# EAGLE design ahrs (EAGLE 9.6.1)

## Sheet 1 of 2
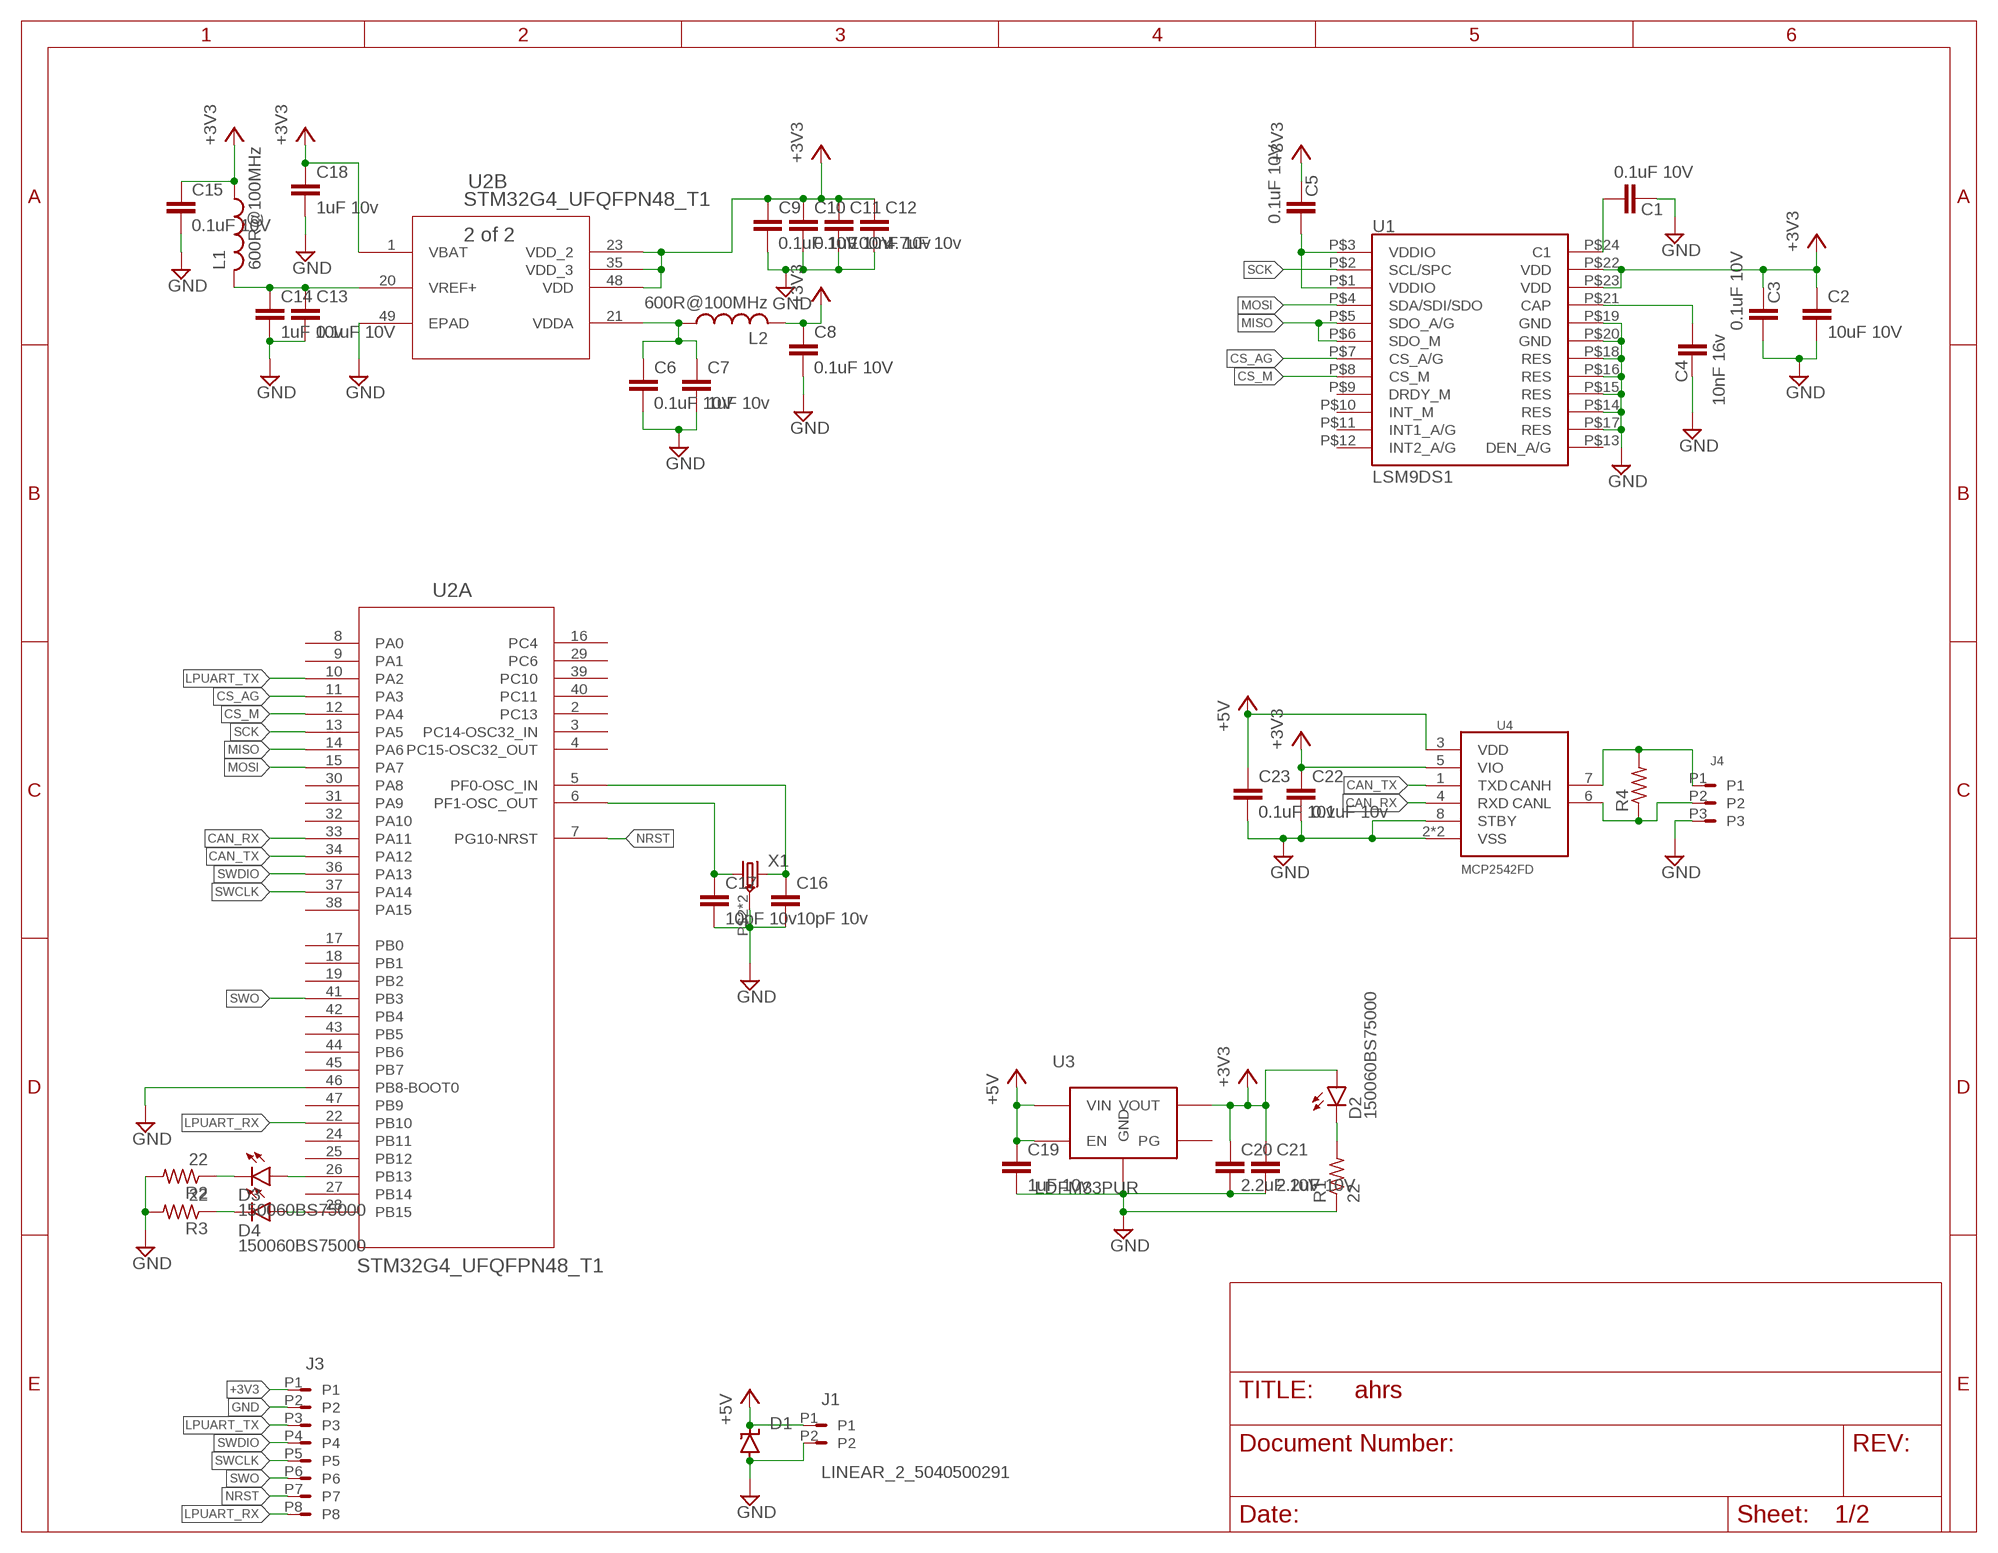
[diagram p0: schematic, sheet 1]

### Parts
C1  0.1uF 10V  C0603  [C0603]
C2  10uF 10V  C0603  [C0603]
C3  0.1uF 10V  C0603  [C0603]
C4  10nF 16v  C0603  [C0603]
C5  0.1uF 10V  C0603  [C0603]
C6  0.1uF 10V  C0603  [C0603]
C7  1uF 10v  C0603  [C0603]
C8  0.1uF 10V  C0603  [C0603]
C9  0.1uF 10V  C0603  [C0603]
C10  0.1uF 10V  C0603  [C0603]
C11  100nF 10v  C0603  [C0603]
C12  4.7uF 10v  C0603  [C0603]
C13  0.1uF 10V  C0603  [C0603]
C14  1uF 10v  C0603  [C0603]
C15  0.1uF 10V  C0603  [C0603]
C16  10pF 10v  C0603  [C0603]
C17  10pF 10v  C0603  [C0603]
C18  1uF 10v  C0603  [C0603]
C19  1uF 10v  C0603  [C0603]
C20  2.2uF 10V  C0603  [C0603]
C21  2.2uF 10V  C0603  [C0603]
C22  0.1uF 10v  C0603  [C0603]
C23  0.1uF 10v  C0603  [C0603]
D1  TVS_SOD123  [SOD123]
D2  150060BS75000  LED_0603  [D0603]
D3  150060BS75000  LED_0603  [D0603]
D4  150060BS75000  LED_0603  [D0603]
J1  LINEAR_2_5040500291  [MOLEX_5040500291]
J3  LINEAR_85040500891  [MOLEX_5040500891]
J4  LINEAR_35040500391  [MOLEX_5040500391]
L1  600R@100MHz  DC_CHOKE_FERRITE_BEAD_0603  [L0603]
L2  600R@100MHz  DC_CHOKE_FERRITE_BEAD_0603  [L0603]
R1  22  R0603  [R0603]
R2  22  R0603  [R0603]
R3  22  R0603  [R0603]
R4  R0603  [R0603]
U1  LSM9DS1  [LGA24_3.5X3X1]
U2  STM32G4_UFQFPN48_T1  [UFQFPN-48_7X7X0P55MM]
U3  LDFM33PUR  [DFN6_2X2]
U4  MCP2542FD  [TDFN_2X3]
X1  CRYSTAL_NX2016SA-24MHZ-EXS00A-CS11335  [NX201SA]

### Nets
+3V3 [power]: C2.1 C3.1 C5.1 C8.1 C9.1 C10.1 C11.1 C12.1 C15.1 C18.1 C20.1 C21.1 C22.1 D2.2(A) J3.P1 L1.1 L2.2 U1.P$22(VDD) U1.P$23(VDD) U2.1(B:VBAT) U2.23(B:VDD_2) U2.35(B:VDD_3) U2.48(B:VDD) U3.PIN1(VOUT) U4.5(VIO)
+5V [power]: C19.1 C23.1 D1.C J1.P1 U3.PIN5(EN) U3.PIN6(VIN) U4.3(VDD)
CAN_RX: U2.33(A:PA11) U4.4(RXD)
CAN_TX: U2.34(A:PA12) U4.1(TXD)
CS_AG: U1.P$7(CS_A/G) U2.11(A:PA3)
CS_M: U1.P$8(CS_M) U2.12(A:PA4)
GND [power]: C1.1 C2.2 C3.2 C4.1 C6.2 C7.2 C8.2 C9.2 C10.2 C11.2 C12.2 C13.2 C14.2 C15.2 C16.2 C17.2 C18.2 C19.2 C20.2 C21.2 C22.2 C23.2 D1.A J1.P2 J3.P2 J4.P3 R1.1 R2.2 R3.2 U1.P$14(RES) U1.P$15(RES) U1.P$16(RES) U1.P$17(RES) U1.P$18(RES) U1.P$19(GND) U1.P$20(GND) U2.46(A:PB8-BOOT0) U2.49(B:EPAD) U3.PAD(GND) U3.PIN4(GND) U4.2(VSS) U4.8(STBY) U4.PAD(VSS) X1.P$2(GND) X1.P$4(GND)
LPUART_RX: J3.P8 U2.22(A:PB10)
LPUART_TX: J3.P3 U2.10(A:PA2)
MISO: U1.P$5(SDO_A/G) U1.P$6(SDO_M) U2.14(A:PA6)
MOSI: U1.P$4(SDA/SDI/SDO) U2.15(A:PA7)
N$1: D2.1(C) R1.2
N$2: C1.2 U1.P$24(C1)
N$3: C4.2 U1.P$21(CAP)
N$4: C5.2 U1.P$1(VDDIO) U1.P$3(VDDIO)
N$5: C17.1 U2.6(A:PF1-OSC_OUT) X1.P$1
N$6: C16.1 U2.5(A:PF0-OSC_IN) X1.P$3
N$7: D4.2(A) U2.28(A:PB15)
N$8: D3.2(A) U2.26(A:PB13)
N$9: D3.1(C) R2.1
N$10: D4.1(C) R3.1
N$11: J4.P1 R4.2 U4.7(CANH)
N$12: J4.P2 R4.1 U4.6(CANL)
NRST: J3.P7 U2.7(A:PG10-NRST)
SCK: U1.P$2(SCL/SPC) U2.13(A:PA5)
SWCLK: J3.P5 U2.37(A:PA14)
SWDIO: J3.P4 U2.36(A:PA13)
SWO: J3.P6 U2.41(A:PB3)
VDDA [power]: C6.1 C7.1 L2.1 U2.21(B:VDDA)
VREF [power]: C13.1 C14.1 L1.2 U2.20(B:VREF+)
Unconnected: J1.MNT@1(GND) J1.MNT@2(GND) J3.MNT@1(GND) J3.MNT@2(GND) J4.MNT@1(GND) J4.MNT@2(GND) U1.P$9(DRDY_M) U1.P$10(INT_M) U1.P$11(INT1_A/G) U1.P$12(INT2_A/G) U1.P$13(DEN_A/G) U2.2(A:PC13) U2.3(A:PC14-OSC32_IN) U2.4(A:PC15-OSC32_OUT) U2.8(A:PA0) U2.9(A:PA1) U2.16(A:PC4) U2.17(A:PB0) U2.18(A:PB1) U2.19(A:PB2) U2.24(A:PB11) U2.25(A:PB12) U2.27(A:PB14) U2.29(A:PC6) U2.30(A:PA8) U2.31(A:PA9) U2.32(A:PA10) U2.38(A:PA15) U2.39(A:PC10) U2.40(A:PC11) U2.42(A:PB4) U2.43(A:PB5) U2.44(A:PB6) U2.45(A:PB7) U2.47(A:PB9) U3.PIN3(PG)

## Sheet 2 of 2
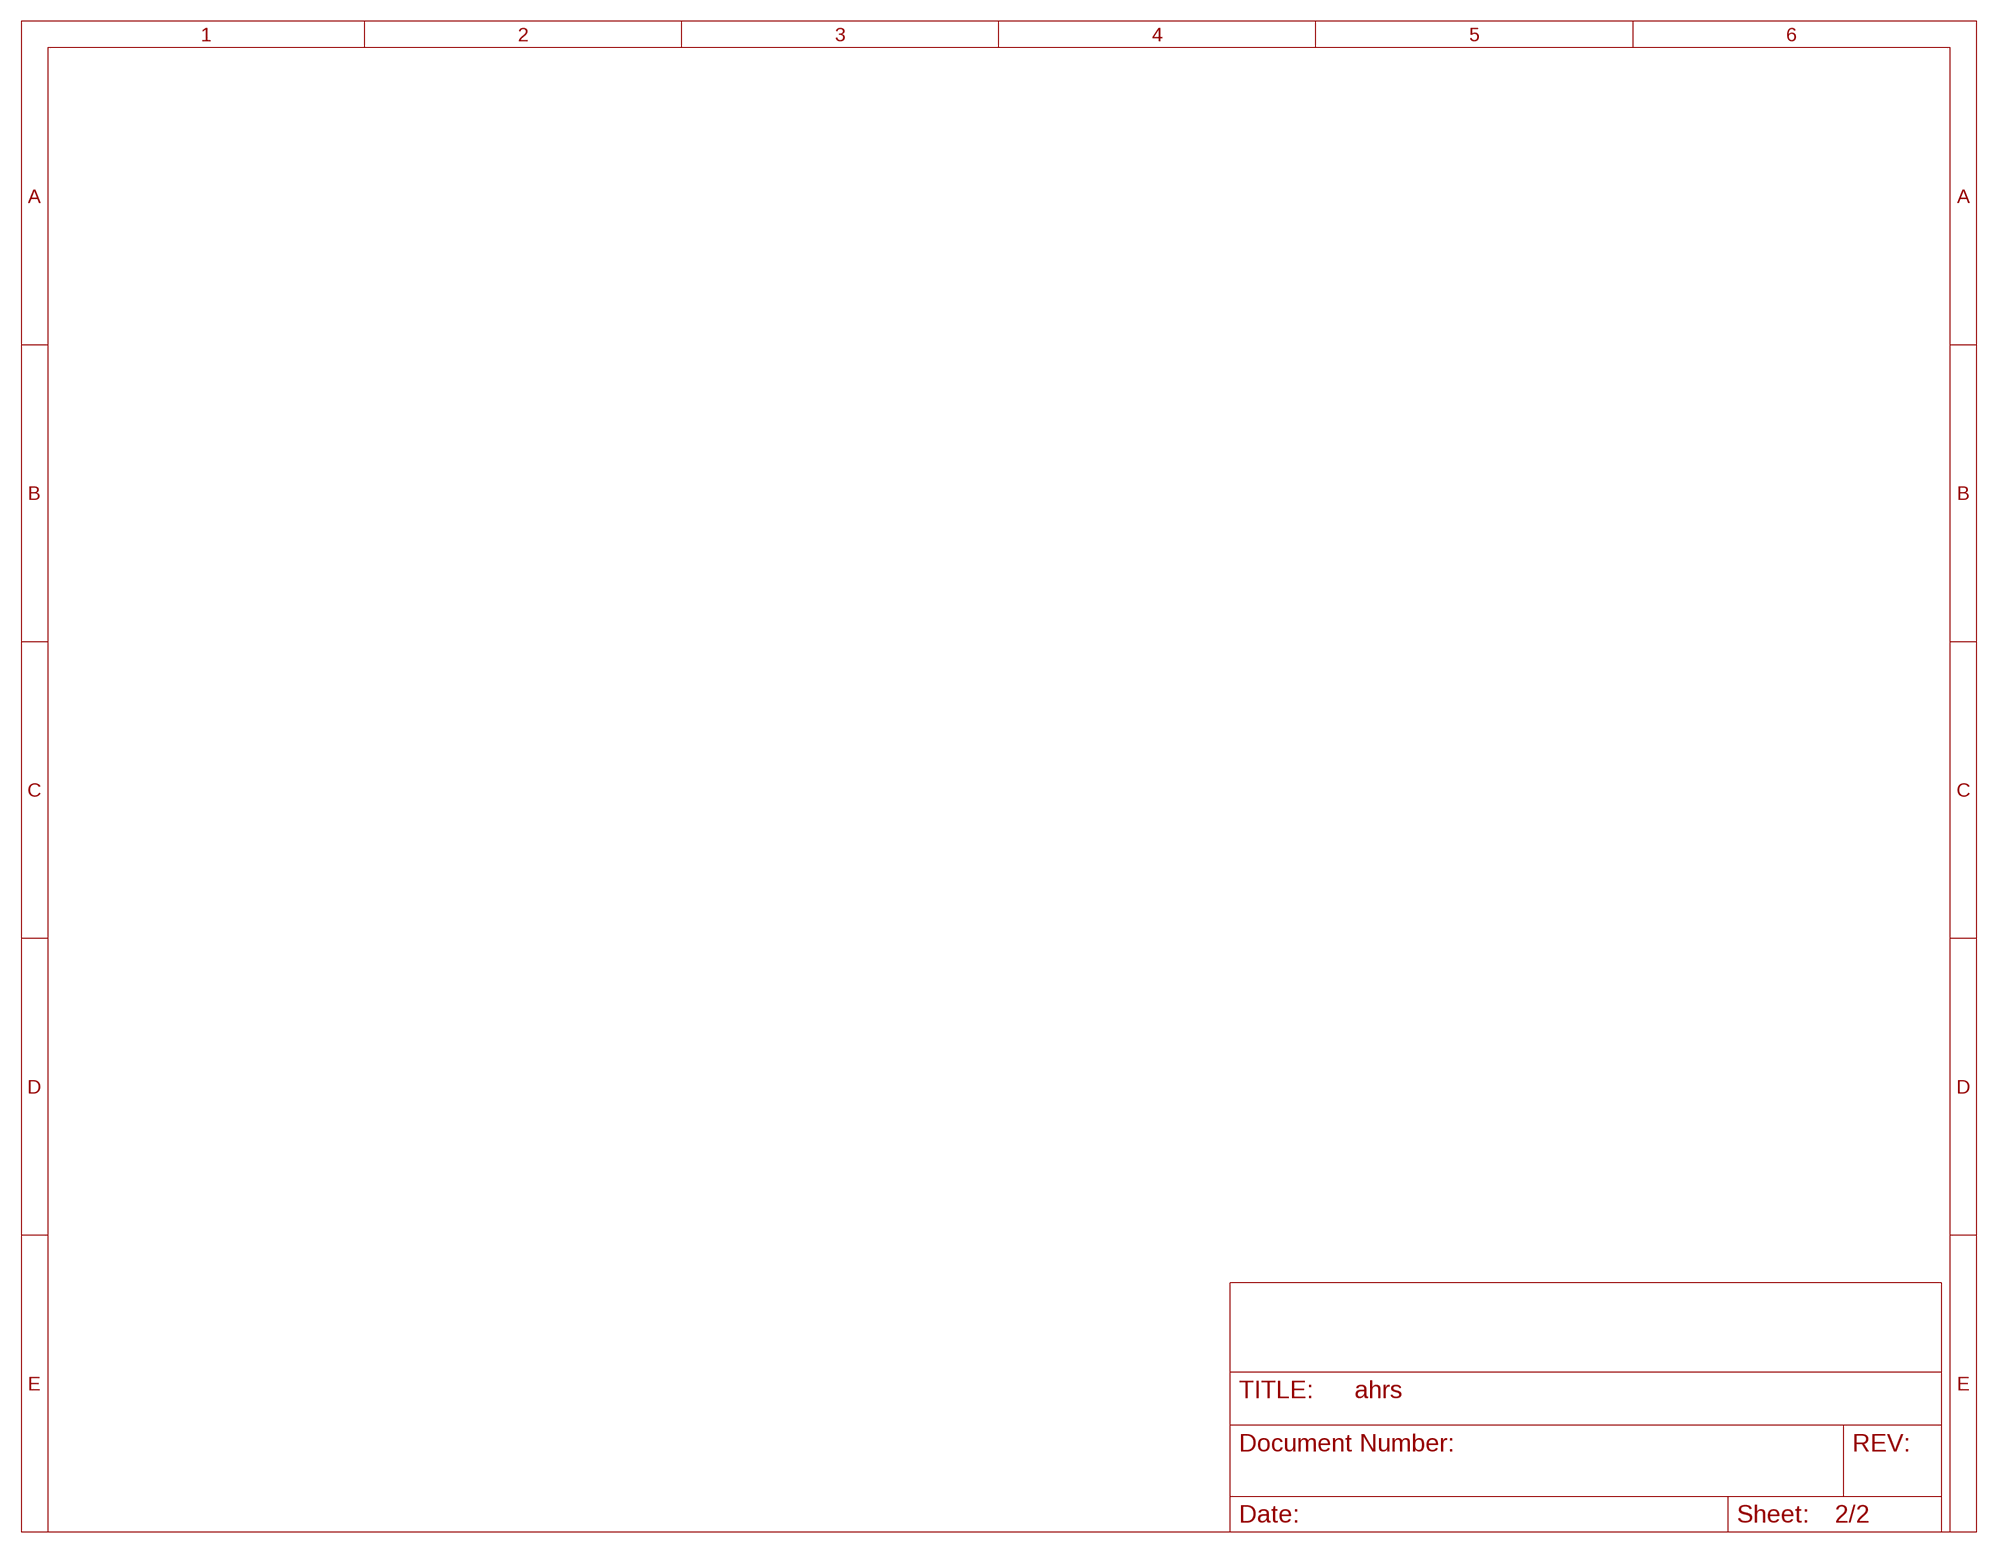
[diagram p1: schematic, sheet 2]

## Library data of the parts
C1-C23 = _T_rcl:C
D1 = _T_rcl:TVS
D2-D4 = _T_rcl:LED
J1 = _T_conn:LINEAR_2
J3 = _T_conn:LINEAR_8
J4 = _T_conn:LINEAR_3
L1 L2 = _T_rcl:DC_CHOKE
R1-R4 = _T_rcl:R
U1 = _T_ic:LSM9DS1: datasheet
U2 = _T_ic:STM32G4_UFQFPN48_T1; BUILT_BY: EMA_Jessica; COPYRIGHT: Copyright (C) 2016 Accelerated Designs. All rights reserved; MANUFACTURER_PART_NUMBER: stm32g4_ufqfpn48_t1; VENDOR: STMicroelectronics
U3 = _T_ic:LDFM
U4 = _T_ic:MCP2542FD
X1 = _T_ic:CRYSTAL

## Net classes
1 power: width 0.3 mm

## Board
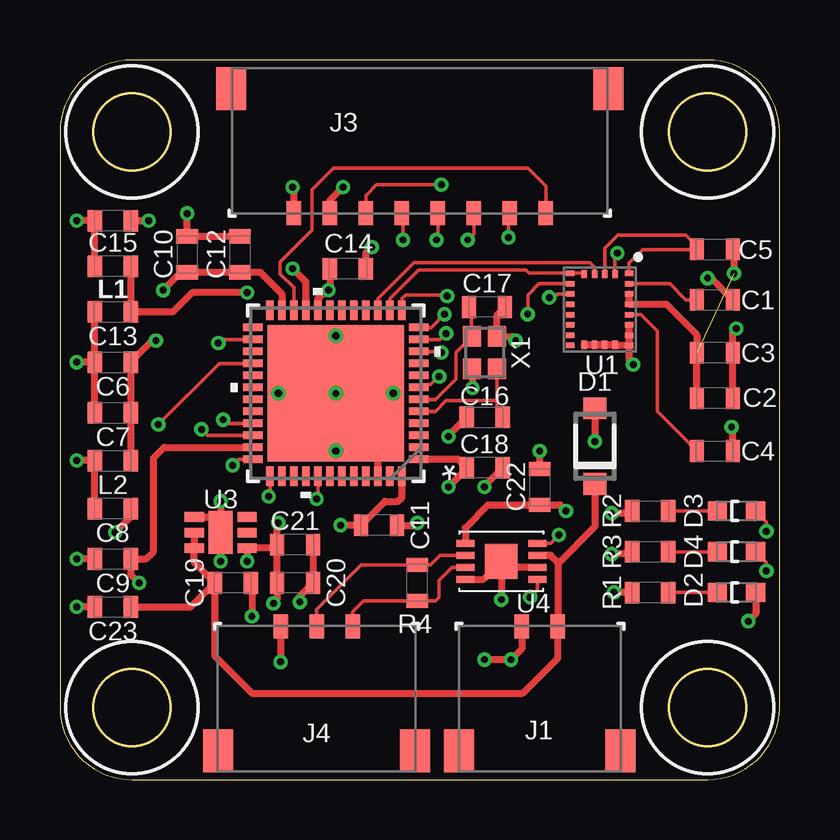
[diagram p2: board, top side]
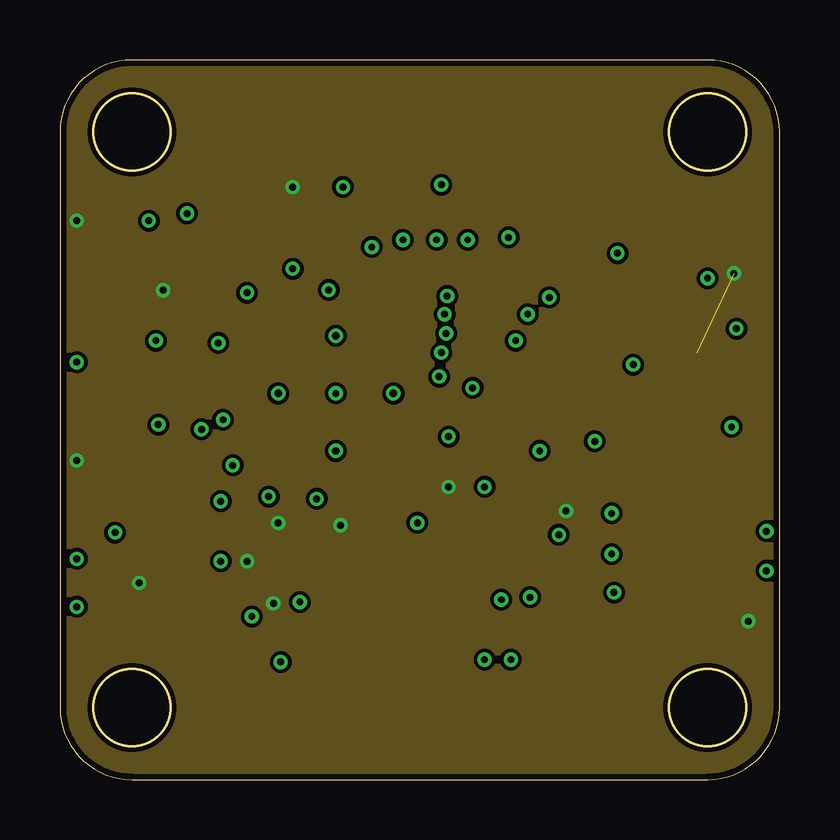
[diagram p3: board, inner layer Route2]
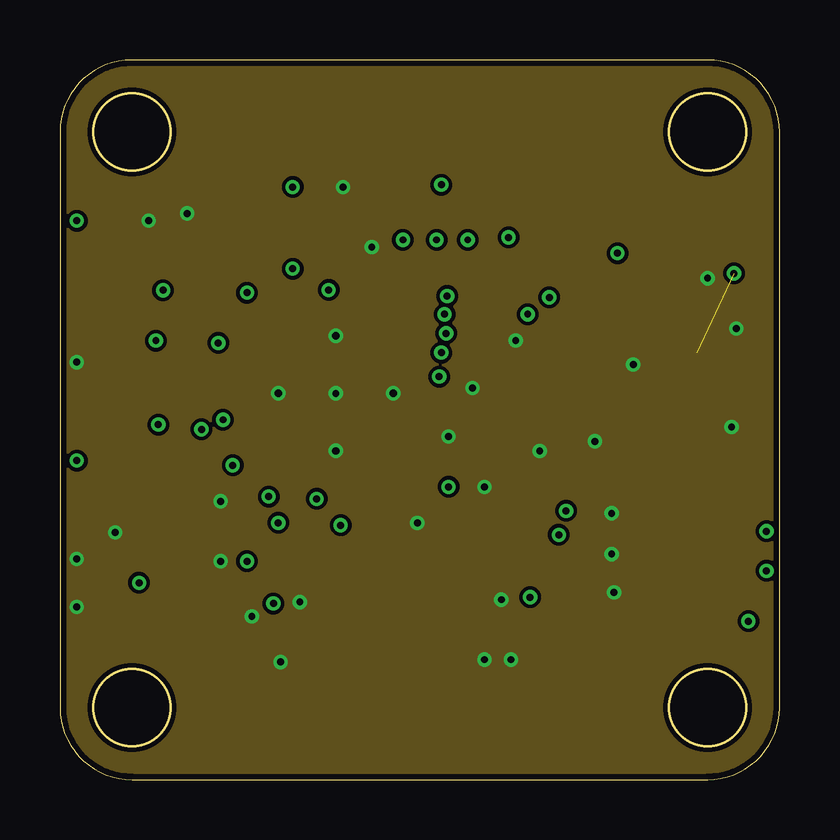
[diagram p4: board, inner layer Route15]
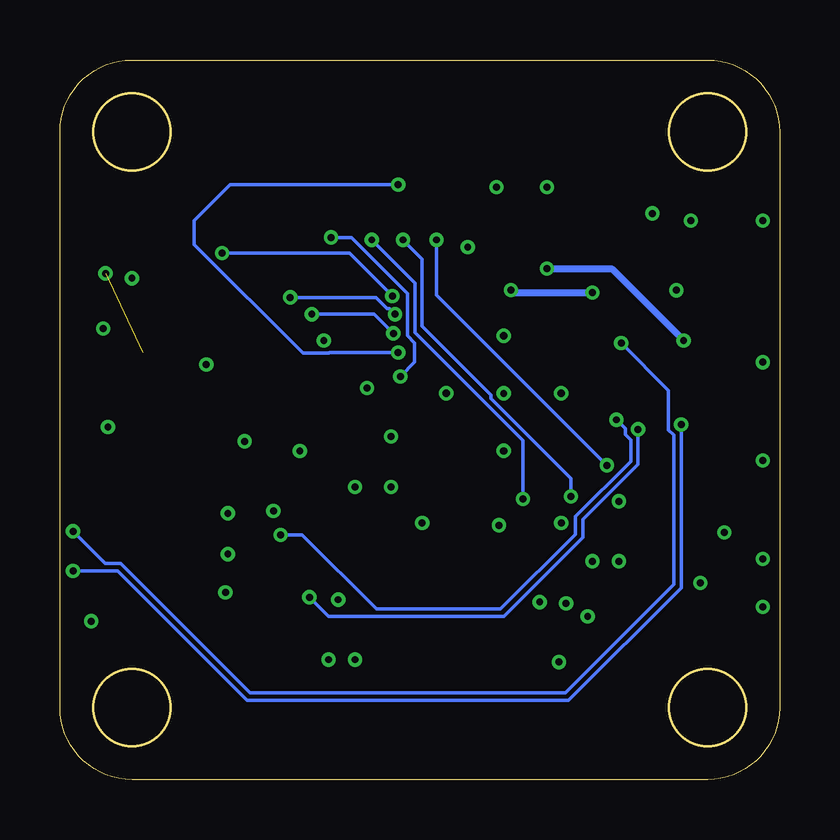
[diagram p5: board, bottom side, seen from below]

Size 30 x 30 mm. Coordinates in mm from the lower left corner, seen from the top.
Outline: 30,27 arc90 27,30 3,30 arc90 0,27 0,3 arc90 3,0 27,0 arc90 30,3 30,27
Outline: circle at 3,3 radius 1.6
Outline: circle at 27,3 radius 1.6
Outline: circle at 3,27 radius 1.6
Outline: circle at 27,27 radius 1.6
Copper layers (1*2*15*16): Top 0.035mm / dielectric 0.11mm / Route2 0.035mm / dielectric 1.31mm / Route15 0.035mm / dielectric 0.11mm / Bottom 0.035mm
Design rules "pcbway_4_layer_TIM": minimum track width 6mil, minimum drill 0.29mm, track to track 6mil, track to pad 6mil, pad to pad 6mil, via to via 6mil, smd to smd 0mil, copper to edge 0.25mm, drill to drill 10mil, minimum pad ring 6mil, minimum via ring 6mil, stop-mask expansion 2mil, vias tented up to drill 0mil, thermal gap 10mil

### Footprints (pad centres in the part's own frame; a part is rotated, then mirrored left to right if it is on the bottom)
C0603 = smd 0.6 x 0.9: 1 0.75,0; 2 -0.75,0
SOD123 = smd 0.9 x 0.95: A 1.575,0; C -1.575,0
D0603 = smd 0.8 x 0.8: 1 -0.8,0; 2 0.8,0
MOLEX_5040500291 = smd 1.25 x 1.8: MNT@1 3.355,5.2; MNT@2 -3.355,5.2 | smd 0.6 x 1: P1 -0.75,0.01; P2 0.75,0.01
MOLEX_5040500891 = smd 1.25 x 1.8: MNT@1 7.855,5.2; MNT@2 -7.855,5.2 | smd 0.6 x 1: P1 -5.25,0.01; P2 -3.75,0.01; P3 -2.25,0.01; P4 -0.75,0.01; P5 0.75,0.01; P6 2.25,0.01; P7 3.75,0.01; P8 5.25,0.01
MOLEX_5040500391 = smd 1.25 x 1.8: MNT@1 4.105,5.2; MNT@2 -4.105,5.2 | smd 0.6 x 1: P1 -1.5,0.01; P2 0,0.01; P3 1.5,0.01
L0603 = smd 0.6 x 0.9: 1 0.75,0; 2 -0.75,0
R0603 = smd 0.6 x 0.9: 1 0.75,0; 2 -0.75,0
LGA24_3.5X3X1 = smd 0.23 x 0.35: P$1 -1.505,1.225; P$6 -1.505,-1.225; P$7 -1.075,-1.225; P$8 -0.645,-1.225; P$9 -0.215,-1.225; P$10 0.215,-1.225; P$11 0.645,-1.225; P$12 1.075,-1.225; P$13 1.505,-1.225; P$18 1.505,1.225; P$19 1.075,1.225; P$20 0.645,1.225; P$21 0.215,1.225; P$22 -0.215,1.225; P$23 -0.645,1.225; P$24 -1.075,1.225 | smd 0.35 x 0.23: P$2 -1.475,0.645; P$3 -1.475,0.215; P$4 -1.475,-0.215; P$5 -1.475,-0.645; P$14 1.475,-0.645; P$15 1.475,-0.215; P$16 1.475,0.215; P$17 1.475,0.645
UFQFPN-48_7X7X0P55MM = smd 0.813 x 0.305: 1 -3.454,2.75; 2 -3.454,2.25; 3 -3.454,1.75; 4 -3.454,1.25; 5 -3.454,0.75; 6 -3.454,0.25; 7 -3.454,-0.25; 8 -3.454,-0.75; 9 -3.454,-1.25; 10 -3.454,-1.75; 11 -3.454,-2.25; 12 -3.454,-2.75; 25 3.454,-2.75; 26 3.454,-2.25; 27 3.454,-1.75; 28 3.454,-1.25; 29 3.454,-0.75; 30 3.454,-0.25; 31 3.454,0.25; 32 3.454,0.75; 33 3.454,1.25; 34 3.454,1.75; 35 3.454,2.25; 36 3.454,2.75 | smd 0.305 x 0.813: 13 -2.75,-3.454; 14 -2.25,-3.454; 15 -1.75,-3.454; 16 -1.25,-3.454; 17 -0.75,-3.454; 18 -0.25,-3.454; 19 0.25,-3.454; 20 0.75,-3.454; 21 1.25,-3.454; 22 1.75,-3.454; 23 2.25,-3.454; 24 2.75,-3.454; 37 2.75,3.454; 38 2.25,3.454; 39 1.75,3.454; 40 1.25,3.454; 41 0.75,3.454; 42 0.25,3.454; 43 -0.25,3.454; 44 -0.75,3.454; 45 -1.25,3.454; 46 -1.75,3.454; 47 -2.25,3.454; 48 -2.75,3.454 | smd 5.69 x 5.69: 49 0,0
DFN6_2X2 = smd 1.8 x 1: PAD 0,0 | smd 0.4 x 0.8: PIN1 0.65,1.1; PIN2 0,1.1; PIN3 -0.65,1.1; PIN4 -0.65,-1.1; PIN5 0,-1.1; PIN6 0.65,-1.1
TDFN_2X3 = smd 0.3 x 0.75: 1 -0.75,-1.5; 2 -0.25,-1.5; 3 0.25,-1.5; 4 0.75,-1.5; 5 0.75,1.5; 6 0.25,1.5; 7 -0.25,1.5; 8 -0.75,1.5 | smd 1.46 x 1.36: PAD 0,0
NX201SA = smd 0.85 x 0.75: P$1 -0.675,-0.525; P$2 0.675,-0.525; P$3 0.675,0.525; P$4 -0.675,0.525

### Placement (x,y rotation side)
C1  27.3,20 0 top
C2  27.3,15.9 180 top
C3  27.3,17.8 180 top
C4  27.3,13.7 0 top
C5  27.3,22.1 0 top
C6  2.2,17.4 0 top
C7  2.2,15.3 0 top
C8  2.2,11.3 180 top
C9  2.2,9.2 0 top
C10  5.3,21.9 270 top
C11  13.3,10.6 180 top
C12  7.5,21.9 270 top
C13  2.2,19.5 0 top
C14  12,21.3 180 top
C15  2.2,23.3 180 top
C16  17.7,15.1 0 top
C17  17.8,19.7 180 top
C18  17.7,13 180 top
C19  7.2,8.2 180 top
C20  9.8,8.2 180 top
C21  9.8,9.8 180 top
C22  20,12.2 270 top
C23  2.2,7.2 0 top
D1  22.3,13.9 90 top
D2  28.2,7.8 0 top
D3  28.2,11.2 0 top
D4  28.2,9.5 0 top
J1  20,6.4 180 top
J3  15,23.6 0 top
J4  10.7,6.4 180 top
L1  2.2,21.4 180 top
L2  2.2,13.3 0 top
R1  24.6,7.8 180 top
R2  24.6,11.2 0 top
R3  24.6,9.5 0 top
R4  14.9,8.2 90 top
U1  22.5,19.6 270 top
U2  11.5,16.1 180 top
U3  6.7,10.3 270 top
U4  18.4,9.1 90 top
X1  17.7,17.8 270 top

### Tracks (layer width: path | path; a pad name or v marks a point on that pad's centre or on a via)
+3V3  (via drill 0.29)  (1 unrouted)
  Top 0.3: C21.1 C20.1 9.05,7.49 v8.9,7.34 | C21.1 8.9,9.65 U3.PIN1 v7.8,9.1 | C21.1 9.05,10.65 v9.1,10.7 | J3.P1 9.75,24.65 v9.7,24.7 | U4.5 16.9,10.5 17.85,11.45 C22.1 20.85,11.45 v21.1,11.2 | U2.48 14.25,11.75 14.1,11.6 13.55,11.6 C11.1 v11.7,10.6 | U2.1 16.6,13.35 C18.1 16.95,12.95 v16.2,12.2 | D2.2 29,6.9 v28.7,6.6 | U2.23 9.25,20.25 8.35,21.15 C12.1 C10.1 5.05,21.15 v4.3,20.4 | L1.1 C15.1 v0.7,23.3 | v0.7,13.3 L2.2 C8.1 | U2.35 4.35,13.85 3.9,13.4 3.9,9.5 3.6,9.2 C9.1 2.95,8.55 v3.3,8.2 | U1.P$23 U1.P$22 25.29,19.82 26.55,18.55 C3.1 C2.1 | C5.1 28.1,22.05 v28.1,21.1
  pour Route2: -0.4,-0.6 32.4,-0.6 32.4,30.5 -0.5,30.5 -0.5,-0.6
+5V
  Top 0.3: U4.3 20.45,9.35 20.75,9.05 20.75,9 | C19.1 6.45,5.15 8,3.6 19.3,3.6 20.75,5.05 J1.P1 20.75,9 | U3.PIN5 U3.PIN6 5.6,9.05 C19.1 | C23.1 5.45,7.2 C19.1 | D1.C 22.3,10.55 20.75,9
CAN_RX  (via drill 0.29)
  Top 0.152: U2.33 6.95,14.85 v6.8,15 | v20.8,10.2 20.45,9.85 U4.4
  Bottom 0.152: v6.8,15 6.43,14.63 6.43,14.38 6.21,14.16 6.21,13.27 8.51,10.97 8.51,10.23 11.63,7.11 16.8,7.11 19.9,10.2 v20.8,10.2
CAN_TX  (via drill 0.29)
  Top 0.152: U4.1 19.9,7.9 v19.6,7.6 | v5.9,14.6 6.15,14.35 U2.34
  Bottom 0.152: v19.6,7.6 18.8,6.8 11.5,6.8 8.2,10.1 8.2,10.84 5.9,13.14 v5.9,14.6
CS_AG  (via drill 0.29)
  Top 0.152: U2.11 15.85,18.35 v16.1,18.6 | v19.5,19.4 19.5,20.2 19.98,20.68 U1.P$7
  Bottom 0.152: v16.1,18.6 16.9,19.4 v19.5,19.4
CS_M  (via drill 0.29)
  Top 0.152: U2.12 15.49,18.85 v16.04,19.4 | U1.P$8 20.75,20.25 20.6,20.1 v20.4,20.1
  Bottom 0.152: v16.04,19.4 16.27,19.63 16.36,19.63 16.83,20.1 v20.4,20.1
GND  (via drill 0.29, 0.3)
  Top 0.3: U4.2 18.65,8.85 U4.PAD | U4.8 17.65,8.35 U4.PAD | J1.P2 19.25,5.45 v18.8,5 v17.7,5 | J4.P3 v9.2,4.9 | C19.2 8,8.15 v8,6.8 | U4.PAD v18.4,7.5 | C21.2 C20.2 10,7.65 v10,7.4 | C11.2 14.8,10.6 v14.9,10.7 | U3.PIN4 6.7,10.95 U3.PAD | v6.7,11.6 U3.PAD | U3.PAD v6.7,9.1 | C23.2 v0.7,7.2 | C9.2 v0.7,9.2 | U2.46 13.25,14.35 U2.49 | D1.A v22.3,14.1 | C18.2 17.7,12.25 v17.7,12.2 | C22.2 v20,13.7 | X1.P$2 17.2,17.1 v17.2,16.33 | v19,18.3 18.82,18.48 X1.P$4 18.23,19.38 C17.2 | C16.2 16.2,14.35 v16.2,14.3 | R1.1 v23.1,7.8 | R3.2 23.75,9.4 v23,9.4 | R2.2 23.75,11.1 v23,11.1 | C12.2 C10.2 v5.3,23.6 | C15.2 v3.7,23.3 | C6.2 C13.2 | C6.2 v0.7,17.4 | v28.2,18.8 28.05,18.65 C3.2 C2.2 | C1.1 27.15,20.9 v27,20.9 | C4.1 28.05,14.65 v28,14.7 | U1.P$20 U1.P$19 U1.P$18 | U1.P$18 23.18,18.09 U1.P$17 U1.P$16 U1.P$15 U1.P$14 | U1.P$18 23.73,17.48 v23.9,17.3 | J3.P2 11.25,24.15 v11.8,24.7 | C8.2 2.95,10.95 v2.3,10.3 | C7.2 C6.2 | C14.2 12.75,21.95 v13,22.2
  other vias: 11.5,16.1 11.5,13.7 13.9,16.1 11.5,18.5 9.1,16.1
  pour Route15 (no thermals): -0.5,-0.5 32.4,-0.5 32.4,30.5 -0.5,30.5
LPUART_RX
  Top 0.152: U2.22 9.75,20.51 9.17,21.08 9.17,21.57 10.5,22.9 10.5,24.6 11.4,25.5 19.5,25.5 20.25,24.75 J3.P8
LPUART_TX  (via drill 0.29)
  Top 0.152: J3.P3 12.75,24.35 13.2,24.8 v15.9,24.8 | U2.10 15.85,17.85 v15.9,17.8
  Bottom 0.152: v15.9,17.8 18.76,17.8 18.78,17.77 19.87,17.77 24.4,22.3 24.4,23.3 22.9,24.8 v15.9,24.8
MISO
  Top 0.152: U2.14 13.75,20.05 14.95,21.25 19.42,21.25 19.56,21.11 U1.P$6 21.82,21.11 U1.P$5
MOSI
  Top 0.152: U2.15 13.25,20.05 14.75,21.55 22.09,21.55 22.29,21.36 U1.P$4
N$1
  Top 0.152: D2.1 R1.2
N$2
  Top 0.152: C1.2 26.1,20 25.43,20.68 U1.P$24
N$3
  Top 0.152: C4.2 24.9,15.35 24.9,18.7 24.21,19.39 U1.P$21
N$4
  Top 0.152: U1.P$3 22.72,22.16 23.26,22.7 26.1,22.7 26.55,22.25 C5.2 24.3,22.1 23.73,21.52 U1.P$1
N$5
  Top 0.152: U2.6 15.65,15.85 16.5,16.7 16.5,17.8 17.15,18.45 | 17.15,18.45 X1.P$1 | C17.1 17.15,19.6 17.15,18.45
N$6
  Top 0.152: C16.1 18.23,15.32 18.23,15.8 | 18.23,15.8 X1.P$3 | U2.5 15.65,15.35 16.1,15.8 18.23,15.8
N$7  (via drill 0.29)
  Top 0.152: U2.28 6.65,17.35 v4.1,14.8 | v29.45,8.7 29.45,9.05 D4.2
  Bottom 0.152: v4.1,14.8 4.1,8 8.8,3.3 22.2,3.3 27.6,8.7 v29.45,8.7
N$8  (via drill 0.29)
  Top 0.152: D3.2 29.45,10.75 v29.45,10.35 | v6.6,18.2 6.75,18.35 U2.26
  Bottom 0.152: v29.45,10.35 28.11,9.01 27.47,9.01 22.07,3.6 8.93,3.6 4.41,8.13 4.41,14.36 4.63,14.58 4.63,16.23 v6.6,18.2
N$9
  Top 0.152: D3.1 R2.1
N$10
  Top 0.152: D4.1 R3.1
N$11
  Top 0.152: U4.7 16.35,8.85 15.8,8.3 15.8,7.6 15.65,7.45 R4.2 12.65,7.45 12.2,7 J4.P1
N$12
  Top 0.152: U4.6 15.85,9.35 15.45,8.95 R4.1 12.55,8.95 10.7,7.1 J4.P2
NRST  (via drill 0.29)
  Top 0.152: U2.7 15.07,16.47 15.46,16.47 15.79,16.8 v15.81,16.8 | v18.7,22.6 18.7,23.56 J3.P7
  Bottom 0.152: v15.81,16.8 15.21,17.4 15.21,18.2 15.51,18.5 15.51,20.27 17.84,22.6 v18.7,22.6
SCK  (via drill 0.29)
  Top 0.152: U2.13 14.25,20.05 14.4,20.2 16.1,20.2 v16.14,20.16 | v23.24,21.94 23.14,21.84 U1.P$2
  Bottom 0.152: v16.14,20.16 17.93,21.94 v23.24,21.94
SWCLK  (via drill 0.29)
  Top 0.152: U2.37 8.75,11.85 v8.7,11.8 | v15.7,22.5 15.75,22.55 J3.P5
  Bottom 0.152: v8.7,11.8 8.7,12.56 12.03,15.88 12.03,16.03 14.9,18.9 14.9,21.7 v15.7,22.5
SWDIO  (via drill 0.29)
  Top 0.152: U2.36 7.45,13.35 v7.2,13.1 | v14.3,22.5 14.3,23.56 J3.P4
  Bottom 0.152: v7.2,13.1 14.3,20.2 v14.3,22.5
SWO  (via drill 0.29)
  Top 0.152: J3.P6 17.25,22.75 v17,22.5 | v10.7,11.7 10.75,11.75 U2.41
  Bottom 0.152: v17,22.5 15.21,20.7 15.21,18.63 10.7,14.12 v10.7,11.7
VDDA  (via drill 0.29)
  Top 0.3: U2.21 10.25,20.75 v9.7,21.3 | v4,18.3 3.85,18.3 C6.1 C7.1 L2.1
  Bottom 0.3: v9.7,21.3 7,21.3 v4,18.3
VREF  (via drill 0.29)
  Top 0.3: U2.20 10.75,20.04 10.97,20.26 11.05,20.26 v11.2,20.41 11.25,20.46 C14.1 | v7.8,20.3 5.5,20.3 4.7,19.5 C13.1 L1.2
  Bottom 0.3: v11.2,20.41 11.09,20.3 v7.8,20.3